# EAGLE design TempBar V1 (EAGLE 7.1.0)
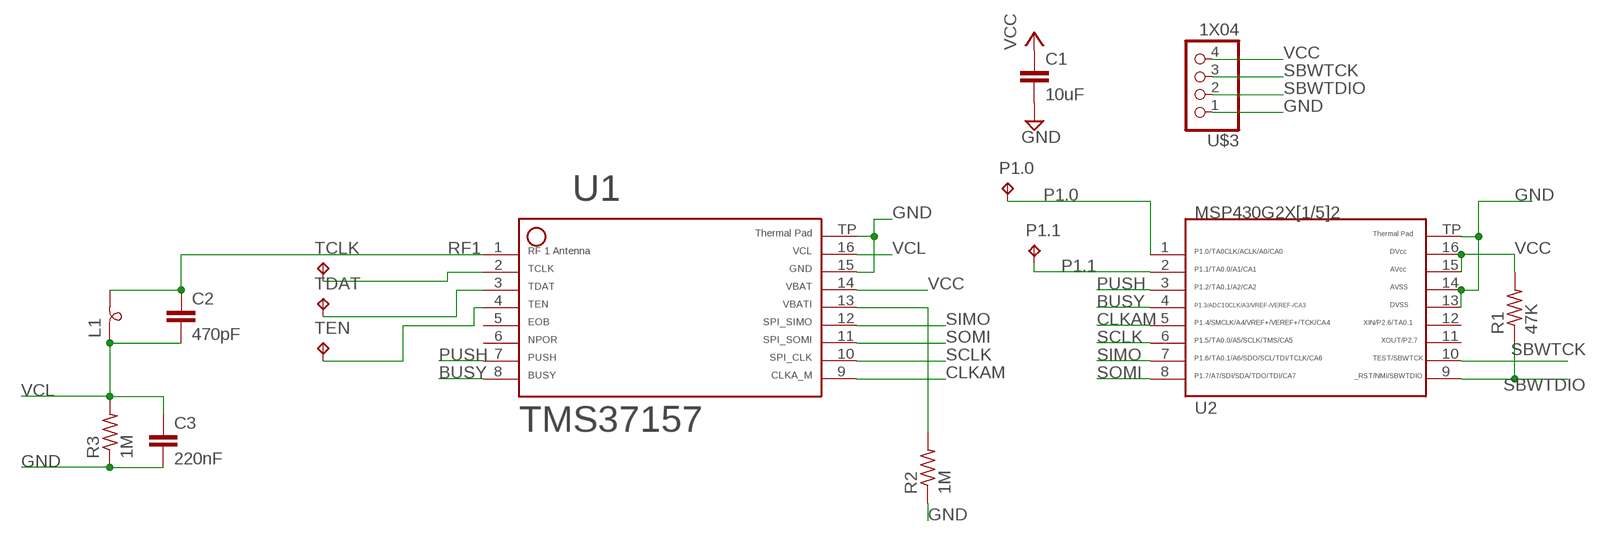
[diagram p0: schematic, sheet 1]

## Parts
C1  10uF  C-EUC0603  [C0603]
C2  470pF  C-EUC0402  [C0402]
C3  220nF  C-EUC0402  [C0402]
L1  SM-B5  [SM-B5]
P1.0  TPTP08R  [TP08R]
P1.1  TPTP08R  [TP08R]
R1  47K  R-US_R0402  [R0402]
R2  1M  R-US_R0402  [R0402]
R3  1M  R-US_R0402  [R0402]
TCLK  TPTP08R  [TP08R]
TDAT  TPTP08R  [TP08R]
TEN  TPTP08R  [TP08R]
U1  TMS37157  [RSA16]
U2  G2X[1/5]2---RSA16  [RSA16]
U$3  1X04  [1X06]

## Nets
BUSY: U1.8 U2.4
CLKAM: U1.9 U2.5
GND: C1.2 C3.2 R2.1 R3.1 U1.15 U1.TP(PP) U2.13 U2.14 U2.TP U$3.1
N$1: R2.2 U1.13
N$7: TCLK.TP U1.2
N$9: TDAT.TP U1.3
N$10: TEN.TP U1.4
P1.0: P1.0.TP U2.1
P1.1: P1.1.TP U2.2
PUSH: U1.7 U2.3
RF1: C2.1 L1.2 U1.1
SBWTCK: U2.10 U$3.3
SBWTDIO: R1.1 U2.9 U$3.2
SCLK: U1.10 U2.6
SIMO: U1.12 U2.7
SOMI: U1.11 U2.8
VCC: C1.1 R1.2 U1.14 U2.15 U2.16 U$3.4
VCL: C2.2 C3.1 L1.1 R3.2 U1.16
Unconnected: U1.5 U1.6 U2.11 U2.12

## Library data of the parts
C1-C3 = rcl:C-EU: CAPACITOR, European symbol
L1 = inductor-neosid:SM-B: INDUCTOR SMD Bead inductor; OC_FARNELL: unknown; OC_NEWARK: unknown
P1.0 P1.1 TCLK TDAT TEN = testpad:TP: Test pad
R1-R3 = resistor:R-US_: RESISTOR, American symbol
U1 = TI_MSP430_v16:TMS37157
U2 = TI_MSP430_v16:G2X[1/5]2---RSA16: MSP430G2X[1/5]2 MSP430G2x52, MSP430G2x12 QFN (RSA) 16 Pin Package http://focus.ti.com/docs/prod/folders/print/msp430g2452.html
U$3 = TempBar V1:1X04

## Board
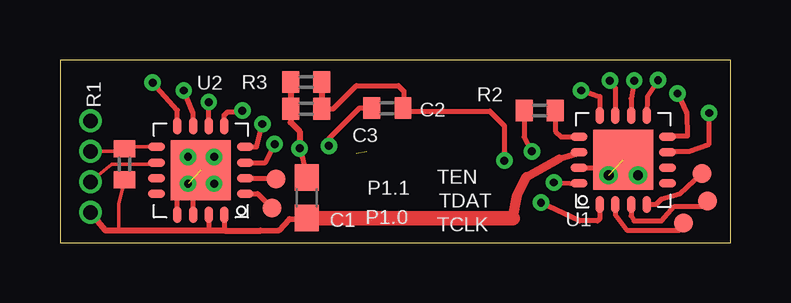
[diagram p1: board, top side]
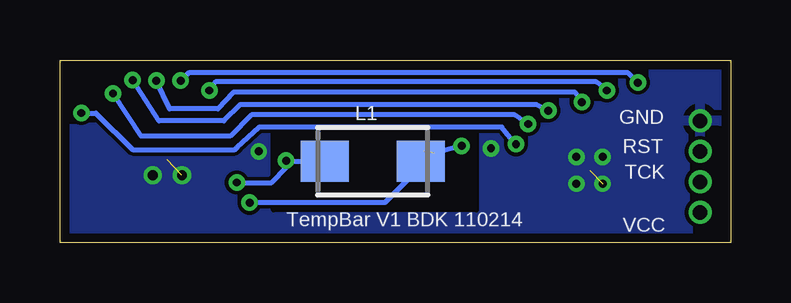
[diagram p2: board, bottom side, seen from below]

Size 27.94 x 7.62 mm. Coordinates in mm from the lower left corner, seen from the top.
Outline: 0,0 27.94,0 27.94,7.62 0,7.62 0,0
Copper layers (1*16): Top 0.0356mm / dielectric 1.5011mm / Bottom 0.0356mm
Design rules "LaenPCBOrder": minimum track width 6mil, minimum drill 13mil, track to track 6mil, track to pad 6mil, pad to pad 6mil, via to via 6mil, smd to smd 6mil, copper to edge 15mil, drill to drill 6mil, minimum pad ring 7mil, minimum via ring 7mil, stop-mask expansion 3mil, vias tented up to drill 0mil, thermal gap 10mil
bRestrict: area 10.6,1.4 to 19.1,4.8

### Footprints (pad centres in the part's own frame; a part is rotated, then mirrored left to right if it is on the bottom)
C0603 = smd 1.1 x 1: 1 -0.85,0; 2 0.85,0
C0402 = smd 0.7 x 0.9: 1 -0.65,0; 2 0.65,0
SM-B5 = smd 2 x 1.7: 1 -2,0; 2 2,0
TP08R = smd 0.8 x 0.8: TP 0,0
R0402 = smd 0.7 x 0.9: 1 -0.65,0; 2 0.65,0
RSA16 = smd 0.7 x 0.35: 1 -1.85,0.975; 2 -1.85,0.325; 3 -1.85,-0.325; 4 -1.85,-0.975; 9 1.85,-0.975; 10 1.85,-0.325; 11 1.85,0.325; 12 1.85,0.975 | smd 0.35 x 0.7: 5 -0.975,-1.85; 6 -0.325,-1.85; 7 0.325,-1.85; 8 0.975,-1.85; 13 0.975,1.85; 14 0.325,1.85; 15 -0.325,1.85; 16 -0.975,1.85 | smd 2.5 x 2.5: TP 0,0
1X06 = drill 0.6: 1 -3.175,0; 2 -1.905,0; 3 -0.635,0; 4 0.635,0

### Placement (x,y rotation side)
C1  10.29,1.88 90 top
C2  13.64,5.61 0 top
C3  10.26,5.59 180 top
L1  14.91,3.4 0 bottom
P1.0  8.84,1.45 0 top
P1.1  8.99,2.67 0 top
R1  2.69,3.28 270 top
R2  19.99,5.51 0 top
R3  10.26,6.71 0 top
TCLK  25.98,0.84 0 top
TDAT  26.97,1.75 0 top
TEN  26.75,2.9 0 top
U1  23.47,3.45 90 top
U2  5.87,3.02 180 top
U$3  1.27,1.91 270 top

### Tracks (layer width: path | path; a pad name or v marks a point on that pad's centre or on a via)
BUSY  (via drill 0.33)
  Top 0.203: U2.4 8.19,4 v8.43,4.95 | v25.73,6.22 26.11,5.41 26.14,4.45 25.34,4.45 U1.8
  Bottom 0.203: v8.43,4.95 8.99,5.33 19.96,5.33 20.85,4.45 24.56,4.45 v25.73,6.22
CLKAM  (via drill 0.33)
  Top 0.203: U2.5 6.84,5.32 6.99,5.46 7.49,5.46 v7.59,5.51 | v24.92,6.78 24.47,6.1 U1.9
  Bottom 0.203: v7.59,5.51 8.08,5.77 20.42,5.77 21.11,5.08 23.82,5.08 v24.92,6.78
GND  (via drill 0.33, 0.41)  (2 unrouted)
  Top 0.203: R2.1 19.34,4.41 v19.66,3.81 | U2.13 4.89,2.04 4.88,2.06 4.93,2.06 v5.33,2.46 5.54,2.25 U2.14 | U1.15 21.64,3.13 21.64,3.12 22.55,3.12 v22.86,2.82 | C1.2 10.13,3.48 v9.98,3.94
  Top 0.254: R3.1 C3.2 9.61,5.02 9.98,4.65 v9.98,3.94
  other vias: 5.33,3.58 6.43,3.58 6.43,2.46 24.08,2.82
  pour Bottom: 0,7.62 27.94,7.62 27.94,0 0,0
N$1
  Top 0.203: R2.2 20.64,4.66 20.88,4.42 U1.13
N$7
  Top 0.203: U1.2 23.14,1.16 23.62,0.53 25.83,0.53 TCLK.TP
N$9
  Top 0.203: U1.3 23.8,1.12 23.93,0.91 25.07,0.91 25.6,1.52 26.75,1.52 TDAT.TP
N$10
  Top 0.203: U1.4 24.84,1.6 25.07,1.83 25.83,2.06 TEN.TP
P1.0
  Top 0.203: U2.1 8.24,2.05 P1.0.TP
P1.1
  Top 0.203: U2.2 8.96,2.7 P1.1.TP
PUSH  (via drill 0.33)
  Top 0.203: U2.3 8.55,3.35 v8.94,4.12 | U1.7 25.35,3.81 26.21,3.81 27.05,4.12 v27.05,5.41
  Bottom 0.203: v8.94,4.12 9.02,4.17 9.53,4.83 19.63,4.83 20.57,3.96 20.65,3.89 24.92,3.89 26.44,5.41 v27.05,5.41
RF1  (via drill 0.33)  (1 unrouted)
  Top 0.203: U1.1 22.5,1.01 22.4,0.91 21.64,0.91 v20.04,1.68 | C2.1 12.47,5.61 11.2,4.34 v11.2,4.04
  Bottom 0.203: 12.78,3.81 L1.2 | v11.2,4.04 12.34,3.73 14.4,1.68 v20.04,1.68
SBWTCK
  Top 0.152: 3.88,3.37 3.83,3.37 3.89,3.28 2.16,3.28 U$3.3
  Top 0.203: 3.88,3.37 U2.10
SBWTDIO
  Top 0.152: U2.9 2.76,4 R1.1 2.58,3.81 U$3.2
SCLK  (via drill 0.33)
  Top 0.203: U2.6 6.19,5.43 v6.2,5.87 | v23.93,6.76 23.8,6.01 U1.10
  Bottom 0.203: v23.93,6.76 23.37,5.59 21.36,5.59 20.73,6.27 6.48,6.27 v6.2,5.87
SIMO  (via drill 0.33)
  Top 0.203: U2.7 5.54,5.41 v5.16,6.35 | v21.72,6.35 22.5,6.1 U1.12
  Bottom 0.203: v5.16,6.35 5.11,6.35 5.59,6.71 21.46,6.71 v21.72,6.35
SOMI  (via drill 0.33)
  Top 0.203: U2.8 4.89,5.53 v3.86,6.68 | v22.91,6.76 23.14,6.45 U1.11
  Bottom 0.203: v3.86,6.68 4.27,7.09 22.58,7.09 v22.91,6.76
VCC
  Top 0.152: R1.2 2.44,1.64 2.44,0.51
  Top 0.203: U2.15 6.19,0.53 6.17,0.51 | U2.16 6.84,0.52 6.86,0.51
  Top 0.254: U$3.4 1.91,0.51 2.44,0.51 6.17,0.51 6.86,0.51 8.36,0.51 9.14,0.53 9.56,0.99 C1.1 | 20.8,3.5 21.57,3.73 U1.14
  Top 0.356: 19.43,2.74 20.8,3.5
  Top 0.406: 18.86,1.03 19.05,1.98 19.43,2.74
  Top 0.61: C1.1 18.86,1.03
VCL  (via drill 0.33)
  Top 0.203: U1.16 21.58,2.44 v20.57,2.52 | C3.1 11.38,5.59 12.34,6.55 14.1,6.55 14.33,6.33 14.33,5.65 C2.2 14.42,5.49 17.91,5.49 18.52,4.88 v18.52,3.43
  Top 0.254: R3.2 C3.1
  Bottom 0.203: L1.1 18.49,3.4 v18.52,3.43 18.52,3.12 19.13,2.52 v20.57,2.52

### Text on the board
bNames: GND | RST | TCK | TempBar V1 BDK 110214 | VCC